# EAGLE design PCEngine RGB Adapter (EAGLE 6.5.0)
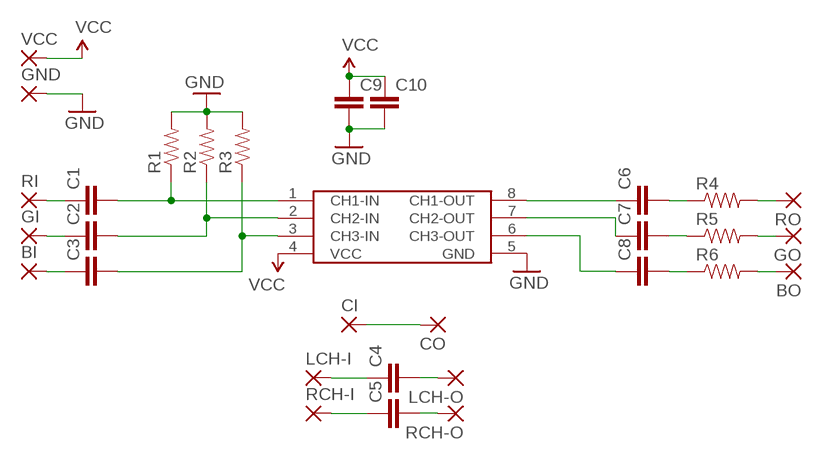
[diagram p0: schematic, sheet 1]

## Parts
BI  WIREPADSMD1,27-254  [SMD1,27-2,54]
BO  WIREPADSMD1,27-254  [SMD1,27-2,54]
C1  CAP0805  [0805]
C2  CAP0805  [0805]
C3  CAP0805  [0805]
C4  CAP0805  [0805]
C5  CAP0805  [0805]
C6  CAP1210  [1210]
C7  CAP1210  [1210]
C8  CAP1210  [1210]
C9  CAP0805  [0805]
C10  CAP0805  [0805]
CI  WIREPADSMD1,27-254  [SMD1,27-2,54]
CO  WIREPADSMD1,27-254  [SMD1,27-2,54]
GI  WIREPADSMD1,27-254  [SMD1,27-2,54]
GND  WIREPADSMD1,27-254  [SMD1,27-2,54]
GO  WIREPADSMD1,27-254  [SMD1,27-2,54]
LCH-I  WIREPADSMD1,27-254  [SMD1,27-2,54]
LCH-O  WIREPADSMD1,27-254  [SMD1,27-2,54]
R1  RESISTOR0805-RES  [0805]
R2  RESISTOR0805-RES  [0805]
R3  RESISTOR0805-RES  [0805]
R4  RESISTOR0805-RES  [0805]
R5  RESISTOR0805-RES  [0805]
R6  RESISTOR0805-RES  [0805]
RCH-I  WIREPADSMD1,27-254  [SMD1,27-2,54]
RCH-O  WIREPADSMD1,27-254  [SMD1,27-2,54]
RI  WIREPADSMD1,27-254  [SMD1,27-2,54]
RO  WIREPADSMD1,27-254  [SMD1,27-2,54]
U$1  THS7314SMD  [SOIC8]
VCC  WIREPADSMD1,27-254  [SMD1,27-2,54]

## Nets
GND: C9.2 C10.2 GND.1(P) R1.2 R2.2 R3.2 U$1.5(GND)
N$1: C1.1 RI.1(P)
N$2: C2.1 GI.1(P)
N$3: BI.1(P) C3.1
N$4: C4.1 LCH-I.1(P)
N$5: C5.1 RCH-I.1(P)
N$6: C1.2 R1.1 U$1.1(CH1-IN)
N$7: C2.2 R2.1 U$1.2(CH2-IN)
N$8: C3.2 R3.1 U$1.3(CH3-IN)
N$9: C6.1 U$1.8(CH1-OUT)
N$10: C6.2 R4.1
N$11: R4.2 RO.1(P)
N$12: GO.1(P) R5.2
N$13: C7.2 R5.1
N$14: C7.1 U$1.7(CH2-OUT)
N$15: C8.1 U$1.6(CH3-OUT)
N$16: C8.2 R6.1
N$17: BO.1(P) R6.2
N$18: C5.2 RCH-O.1(P)
N$19: C4.2 LCH-O.1(P)
N$20: CI.1(P) CO.1(P)
VCC: C9.1 C10.1 U$1.4(VCC) VCC.1(P)

## Library data of the parts
BI BO CI CO GI GND GO LCH-I LCH-O RCH-I RCH-O RI RO VCC = wirepad:WIREPAD: Wire PAD connect wire on PCB
C1-C10 = SparkFun-Capacitors:CAP: Capacitor Standard 0603 ceramic capacitor, and 0.1" leaded capacitor.
R1-R6 = SparkFun-Resistors:RESISTOR: Resistor Basic schematic elements and footprints for 0603, 1206, and PTH resistors.
U$1 = linear:THS7314

## Board
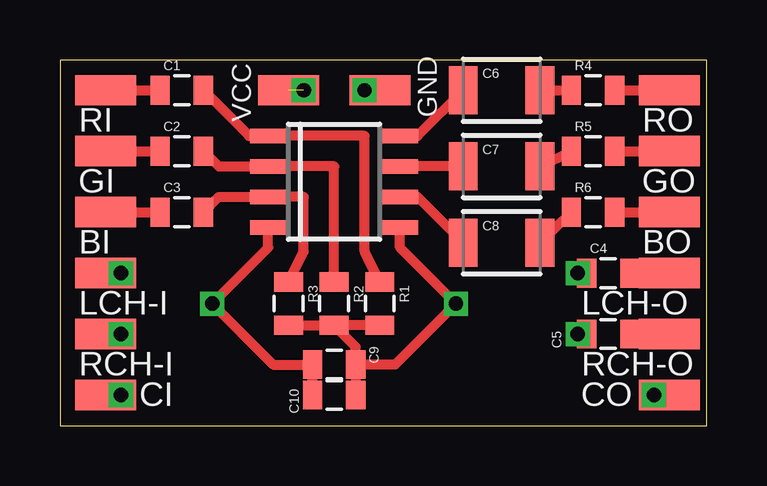
[diagram p1: board, top side]
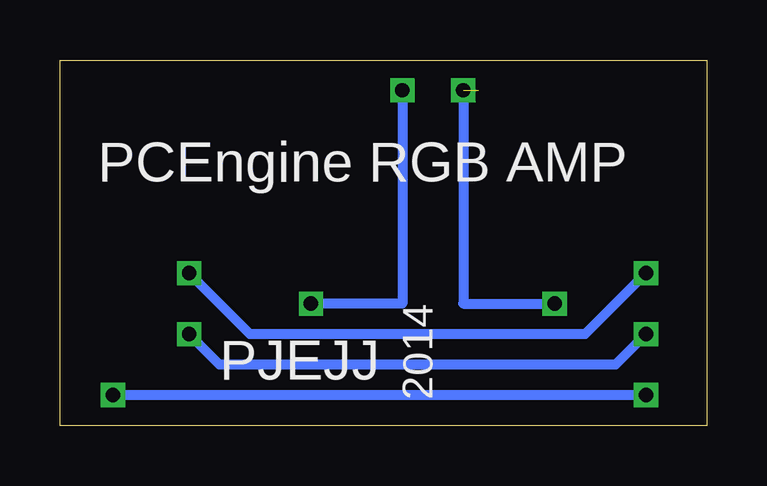
[diagram p2: board, bottom side, seen from below]

Size 26.98 x 15.23 mm. Coordinates in mm from the lower left corner, seen from the top.
Outline: 0,0 26.98,0 26.98,15.23 0,15.23 0,0
Copper layers (1*16): Top 0.035mm / dielectric 1.5mm / Bottom 0.035mm
Design rules "default": minimum track width 10mil, minimum drill 0.6mm, track to track 8mil, track to pad 8mil, pad to pad 8mil, via to via 8mil, smd to smd 8mil, copper to edge 40mil, drill to drill 8mil, minimum pad ring 10mil, minimum via ring 8mil, stop-mask expansion 4mil, vias tented up to drill 0mil, thermal gap 10mil

### Footprints (pad centres in the part's own frame; a part is rotated, then mirrored left to right if it is on the bottom)
SMD1,27-2,54 = smd 1.27 x 2.54: 1 0,0
0805 = smd 0.8 x 1.2: 1 -0.9,0; 2 0.9,0
1210 = smd 1.2 x 2: 1 -1.6,0; 2 1.6,0
SOIC8 = smd 0.6 x 1.5: 1 -1.905,-2.75; 2 -0.635,-2.75; 3 0.635,-2.75; 4 1.905,-2.75; 5 1.905,2.75; 6 0.635,2.75; 7 -0.635,2.75; 8 -1.905,2.75

### Placement (x,y rotation side)
BI  1.91,8.89 270 top
BO  25.4,8.89 270 top
C1  5.08,13.97 0 top
C2  5.08,11.43 0 top
C3  5.08,8.89 0 top
C4  22.86,6.35 0 top
C5  22.86,3.81 0 top
C6  18.41,13.97 0 top
C7  18.41,10.79 0 top
C8  18.41,7.62 0 top
C9  11.43,2.54 0 top
C10  11.43,1.27 0 top
CI  1.91,1.27 270 top
CO  25.4,1.27 270 top
GI  1.91,11.43 270 top
GND  13.34,13.97 270 top
GO  25.4,11.43 270 top
LCH-I  1.91,6.35 270 top
LCH-O  25.4,6.35 270 top
R1  13.34,5.08 270 top
R2  11.43,5.08 270 top
R3  9.53,5.08 270 top
R4  22.23,13.97 0 top
R5  22.23,11.43 0 top
R6  22.23,8.89 0 top
RCH-I  1.91,3.81 270 top
RCH-O  25.4,3.81 270 top
RI  1.91,13.97 270 top
RO  25.4,13.97 270 top
U$1  11.43,10.16 270 top
VCC  9.53,13.97 90 top

### Tracks (layer width: path | path; a pad name or v marks a point on that pad's centre or on a via)
GND  (via drill 0.6)
  Top 0.406: C9.2 C10.2 | R3.2 R2.2 | R1.2 R2.2 | GND.1 v12.7,13.97 | C9.2 13.97,2.54 v16.51,5.08 14.18,7.41 U$1.5 | C9.2 12.33,3.28 R2.2
  Bottom 0.406: v12.7,13.97 12.7,5.08 v16.51,5.08
N$1
  Top 0.406: RI.1 C1.1
N$2
  Top 0.406: GI.1 C2.1
N$3
  Top 0.406: BI.1 C3.1
N$4  (via drill 0.6)
  Top 0.406: LCH-I.1 v2.54,6.35 | v21.59,6.35 C4.1
  Bottom 0.406: v2.54,6.35 5.08,3.81 19.05,3.81 v21.59,6.35
N$5  (via drill 0.6)
  Top 0.406: RCH-I.1 v2.54,3.81 | v21.59,3.81 C5.1
  Bottom 0.406: v2.54,3.81 3.81,2.54 11.43,2.54 20.32,2.54 v21.59,3.81
N$6
  Top 0.406: R1.1 12.7,7.25 12.7,12.06 U$1.1 7.88,12.06 C1.2
N$7
  Top 0.406: R2.1 11.43,10.79 U$1.2 6.62,10.79 C2.2
N$8
  Top 0.406: R3.1 10.16,7.25 10.16,9.53 U$1.3 6.62,9.53 C3.2
N$9
  Top 0.406: C6.1 14.91,12.06 U$1.8
N$10
  Top 0.406: C6.2 R4.1
N$11
  Top 0.406: R4.2 RO.1
N$12
  Top 0.406: R5.2 GO.1
N$13
  Top 0.406: C7.2 R5.1
N$14
  Top 0.406: C7.1 U$1.7
N$15
  Top 0.406: C8.1 14.91,9.53 U$1.6
N$16
  Top 0.406: C8.2 R6.1
N$17
  Top 0.406: R6.2 BO.1
N$18
  Top 0.406: C5.2 RCH-O.1
N$19
  Top 0.406: C4.2 LCH-O.1
N$20  (via drill 0.6)
  Top 0.406: CI.1 v2.54,1.27 | v24.77,1.27 CO.1
  Bottom 0.406: v2.54,1.27 v24.77,1.27
VCC  (via drill 0.6)  (1 unrouted)
  Top 0.406: C10.1 C9.1 8.89,2.54 v6.35,5.08 8.68,7.41 U$1.4
  Bottom 0.406: v10.16,13.97 10.16,5.08 v6.35,5.08

### Text on the board
bPlace: PCEngine RGB AMP | 2014 | PJEJJ